# Altium schematic sheet Power.SchDoc: Top Level
size A3; CompanyName: NOT USED; DocumentNumber: 4; SheetNumber: 4; SheetTotal: 5; PageSetup: Record=PageOptions|CenterHorizontal=True|CenterVertical=True|PrintScale=1.00|XCorrection=1.00|YCorrection=1.00|PrintKind=0|BorderSize=5000000|LeftOffset=0|BottomOffset=0|Orientation=2|PaperLength=1000|PaperWidth=1000|Scale=100|PaperSource=7|PrintQuality=-4|MediaType=1|DitherType=10|PaperKind=A3|PrintScaleMode=0
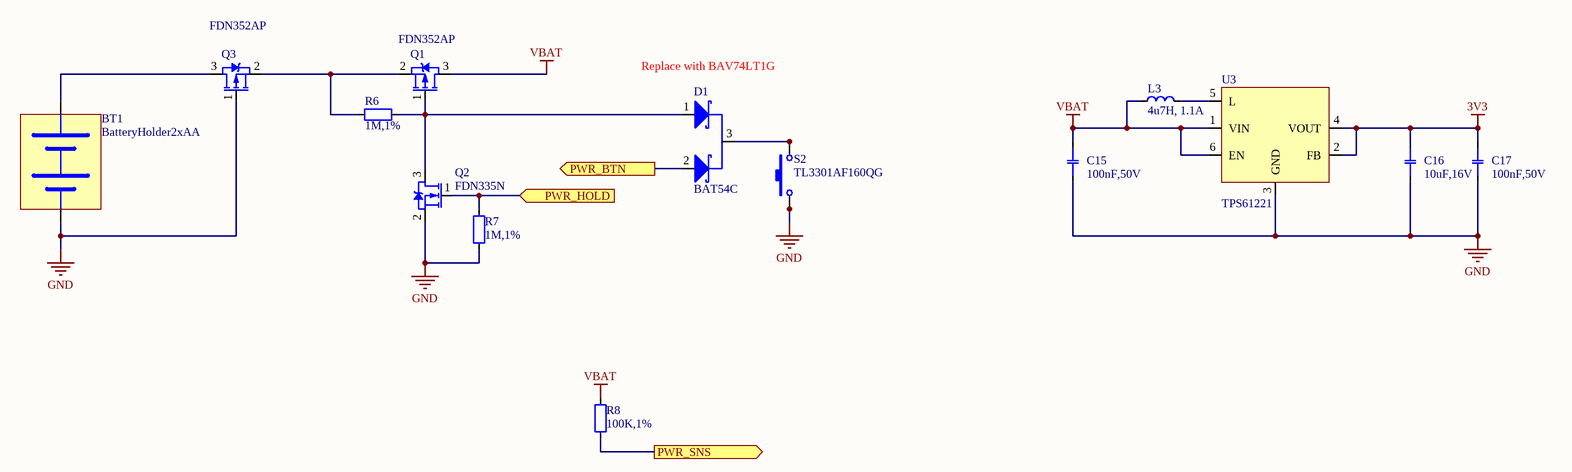
[diagram p0: Power.SchDoc]

## Parts
BT1  BatteryHolder2xAA  [BATTERY_HOLDER_2AA]
C15  100nF,50V  [CAPC1608X09N_0603]
C16  10uF,16V  [CAPC2012X12N_0805]
C17  100nF,50V  [CAPC1608X09N_0603]
D1  BAT54C  [SOT95P237X111-3N_SOT23]
L3  4u7H, 1.1A  [INDC2520X12N_1008]
Q1  FDN352AP  [SOT95P230X110-3N_SOT23]
Q2  FDN335N  [SOT95P230X110-3N_SOT23]
Q3  FDN352AP  [SOT95P230X110-3N_SOT23]
R6  1M,1%  [RESC1608X06N_0603]
R7  1M,1%  [RESC1608X06N_0603]
R8  100K,1%  [RESC1608X06N_0603]
S2  TL3301AF160QG  [SW_TL3301AFXXXXG]
U3  TPS61221  [TSOP65P210X100-6N_SC70]

## Ports
PWR_BTN (out), PWR_HOLD (in), PWR_SNS (out)

## Nets
3V3: C16.2 C17.2 U3.2(FB) U3.4(VOUT)
GND: BT1.2(-) C15.1 C16.1 C17.1 Q2.2(S) Q3.1(G) R7.2 S2.1 S2.2 U3.3(GND)
VBAT: C15.2 L3.1 Q1.3(D) R8.2 U3.1(VIN) U3.6(EN)
PWR_BTN: D1.2(A2) ; port PWR_BTN
PWR_HOLD: Q2.1(G) R7.1 ; port PWR_HOLD
PWR_SNS: R8.1 ; port PWR_SNS
NetBT1_1: BT1.1(+) Q3.3(D)
NetD1_1: D1.1(A1) Q1.1(G) Q2.3(D) R6.1
NetD1_3: D1.3(C1/C2) S2.3 S2.4
NetL3_2: L3.2 U3.5(L)
NetQ1_2: Q1.2(S) Q3.2(S) R6.2

## Notes on the sheet
- (near D1) Replace with BAV74LT1G
- Project
- Size:
- Date:
- A3
- Revision:
- Sheet
- of
- Lambo
- File:

## Library data of the parts
C15 C17 = CCH-104CH-G: CAP CER 0.1UF 50V 10% X7R 0603; Manufacturer: Kemet; Manufacturer Part Number: C0603C104K5RACTU; Type: Ceramic; Display_Name: 100nF,50V; Capacitance: 100nF; Dielectric: X7R; Tolerance: 10%; Voltage: 50V; BWA PN: CCH-104CH-G; Schematic Symbol: CAP-NP_1; Supplier 1: Digi-Key; Supplier Part Number 1: 399-5089-1-ND
C16 = CCI-106CD-G: CAP CER 10µF ±10% 16V X7R 0805; Manufacturer: Samsung Electro-Mechanics America, Inc.; Manufacturer Part Number: CL21B106KOQNNNG; Type: Ceramic; Display_Name: 10uF,16V; Capacitance: 10uF; Dielectric: X7R; Tolerance: 10%; Voltage: 16V; BWA PN: CCI-106CD-G; Schematic Symbol: CAP-NP_1; Supplier 1: Digi-Key; Supplier Part Number 1: 1276-6472-1-ND
D1 = DIO-10192-A: DIODE ARRAY SCHOTTKY 30V SOT23-3; Manufacturer: Fairchild/ON Semiconductor; Vf@I: 800mV @ 100mA; d_if(max): 200mA; Display_Name: BAT54C; Type: Schottky; BWA PN: DIO-10192-A; Vr(max): 30V; Schematic Symbol: BAT54C; Manufacturer Part Number: BAT54C; Supplier 1: Digi-Key; Supplier Part Number 1: BAT54CFSCT-ND
L3 = IND-10165-A: INDUCTOR POWER 4.7UH 1.1A SMD; Manufacturer: Murata Electronics North America; Manufacturer Part Number: DFE252010R-H-4R7M=P2; Sheilding: Unsheilded; Type: Wirewound; DC Resistance: 276mOhm; Display_Name: 4u7H, 1.1A; Inductance: 4u7H; BWA PN: IND-10165-A; Current Rating: 1.1A; Schematic Symbol: INDUCTOR_1; Supplier 1: Digi-Key; Supplier Part Number 1: 490-10646-1-ND
Q1 Q3 = TRN-10006-A: MOSFET P-CH 30V 1.3A SSOT-3; Manufacturer: Fairchild; Type: P; Id(max): -1.3A; rds(on): 180mOhms; Vds(max): -30V; Vgs(max): +/-25V; Vth(max): -2.5V; Display_Name: FDN352AP; BWA PN: TRN-10006-A; Schematic Symbol: MOSFET-P_1; Manufacturer Part Number: FDN352AP; Supplier 1: Digi-Key; Supplier Part Number 1: FDN352APCT-ND
Q2 = TRN-10045-A: MOSFET N-CH 20V 1.7A SSOT3; Manufacturer: Fairchild Semiconductor; Type: N; rds(on): 70mOhm; Vgs(max): +/-8V; Vth(max): 1.5V; Display_Name: FDN335N; BWA PN: TRN-10045-A; Id(max): 1.7A; Vds(max): 20V; Schematic Symbol: MOSFET-N_1; Manufacturer Part Number: FDN335N; Supplier 1: Digi-Key; Supplier Part Number 1: FDN335NCT-ND
R6 R7 = RSH-1M000-D: RES 1.00M OHM 1/10W 1% 0603 SMD; Manufacturer: Yageo; Manufacturer Part Number: RC0603FR-071ML; Power: 0.1W; Display_Name: 1M,1%; Resistance: 1M; Tolerance: 1%; Type: Chip; BWA PN: RSH-1M000-D; Schematic Symbol: RESISTOR_1; Supplier 1: Digi-Key; Supplier Part Number 1: 311-1.00MHRCT-ND
R8 = RSH-100K0-D: RES 100K OHM 1/10W 1% 0603 SMD; Manufacturer: Yageo; Manufacturer Part Number: RC0603FR-07100KL; Power: 0.1W; Display_Name: 100K,1%; Resistance: 100K; Tolerance: 1%; Type: Chip; BWA PN: RSH-100K0-D; Schematic Symbol: RESISTOR_1; Supplier 1: Digi-Key; Supplier Part Number 1: 311-100KHRCT-ND
S2 = SWT-10009-A: SWITCH TACT 160GF H=5.0MM SMT; Manufacturer: E-Switch; Circuit: SPST-NO; Function: Off-Mom; Display_Name: TL3301AF160QG; Type: Tactile; BWA PN: SWT-10009-A; Schematic Symbol: SW_SPST_2; Manufacturer Part Number: TL3301AF160QG; Supplier 1: Digi-Key; Supplier Part Number 1: EG2526CT-ND
U3 = ICT-10893-A: IC REG BOOST 3.3V 200MA SC70-6; Manufacturer: Texas Instruments; Manufacturer Part Number: TPS61221DCKT; Temp Range: -40°C ~ 125°C (TJ); Display_Name: TPS61221; BWA PN: ICT-10893-A; Schematic Symbol: TPS61221; Supplier 1: Digi-Key; Supplier Part Number 1: 296-24171-1-ND